# Altium schematic sheet Voltage Regulator.SchDoc
size A4; SheetNumber: 4; SheetTotal: 6
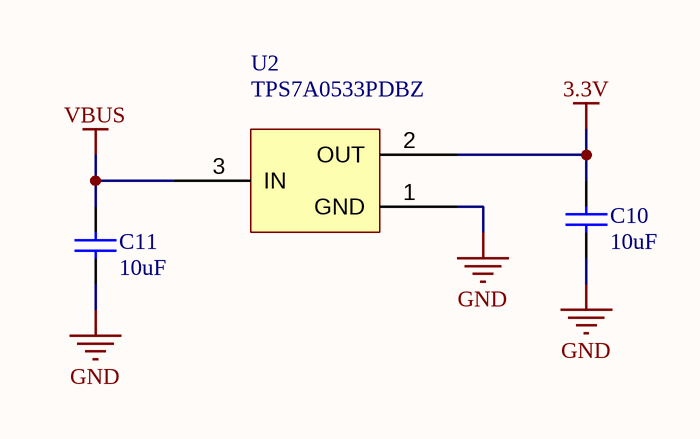
[diagram p0: Voltage Regulator.SchDoc]

## Parts
C10  10uF  [Capacitor 0402]
C11  10uF  [Capacitor 0402]
U2  TPS7A0533PDBZ  [SOT-23]

## Nets
3.3V: C10.2 U2.2(OUT)
GND: C10.1 C11.1 U2.1(GND)
VBUS: C11.2 U2.3(IN)

## Notes on the sheet
- TITLE
- SIZE
- A4
- VARIANT
- PROJECT
- SHEET
- VERSION
- OF
- AUTHOR
- DATE

## Library data of the parts
C10 C11 = Capacitor